# Altium schematic sheet Open Reactor Control System - IO Connections.SchDoc: ORC - IO Connections
size A3; Author: Peake J; CompanyName: Scion Research; DrawnBy: Peake J; Engineer: Peake J; Organization: Scion; Address1: 49 Sala St; Address2: Whakarewarewa; Address3: Rotorua; Address4: New Zealand 3010; DocumentNumber: 0-6; Revision: 5; SheetNumber: 5; SheetTotal: 5
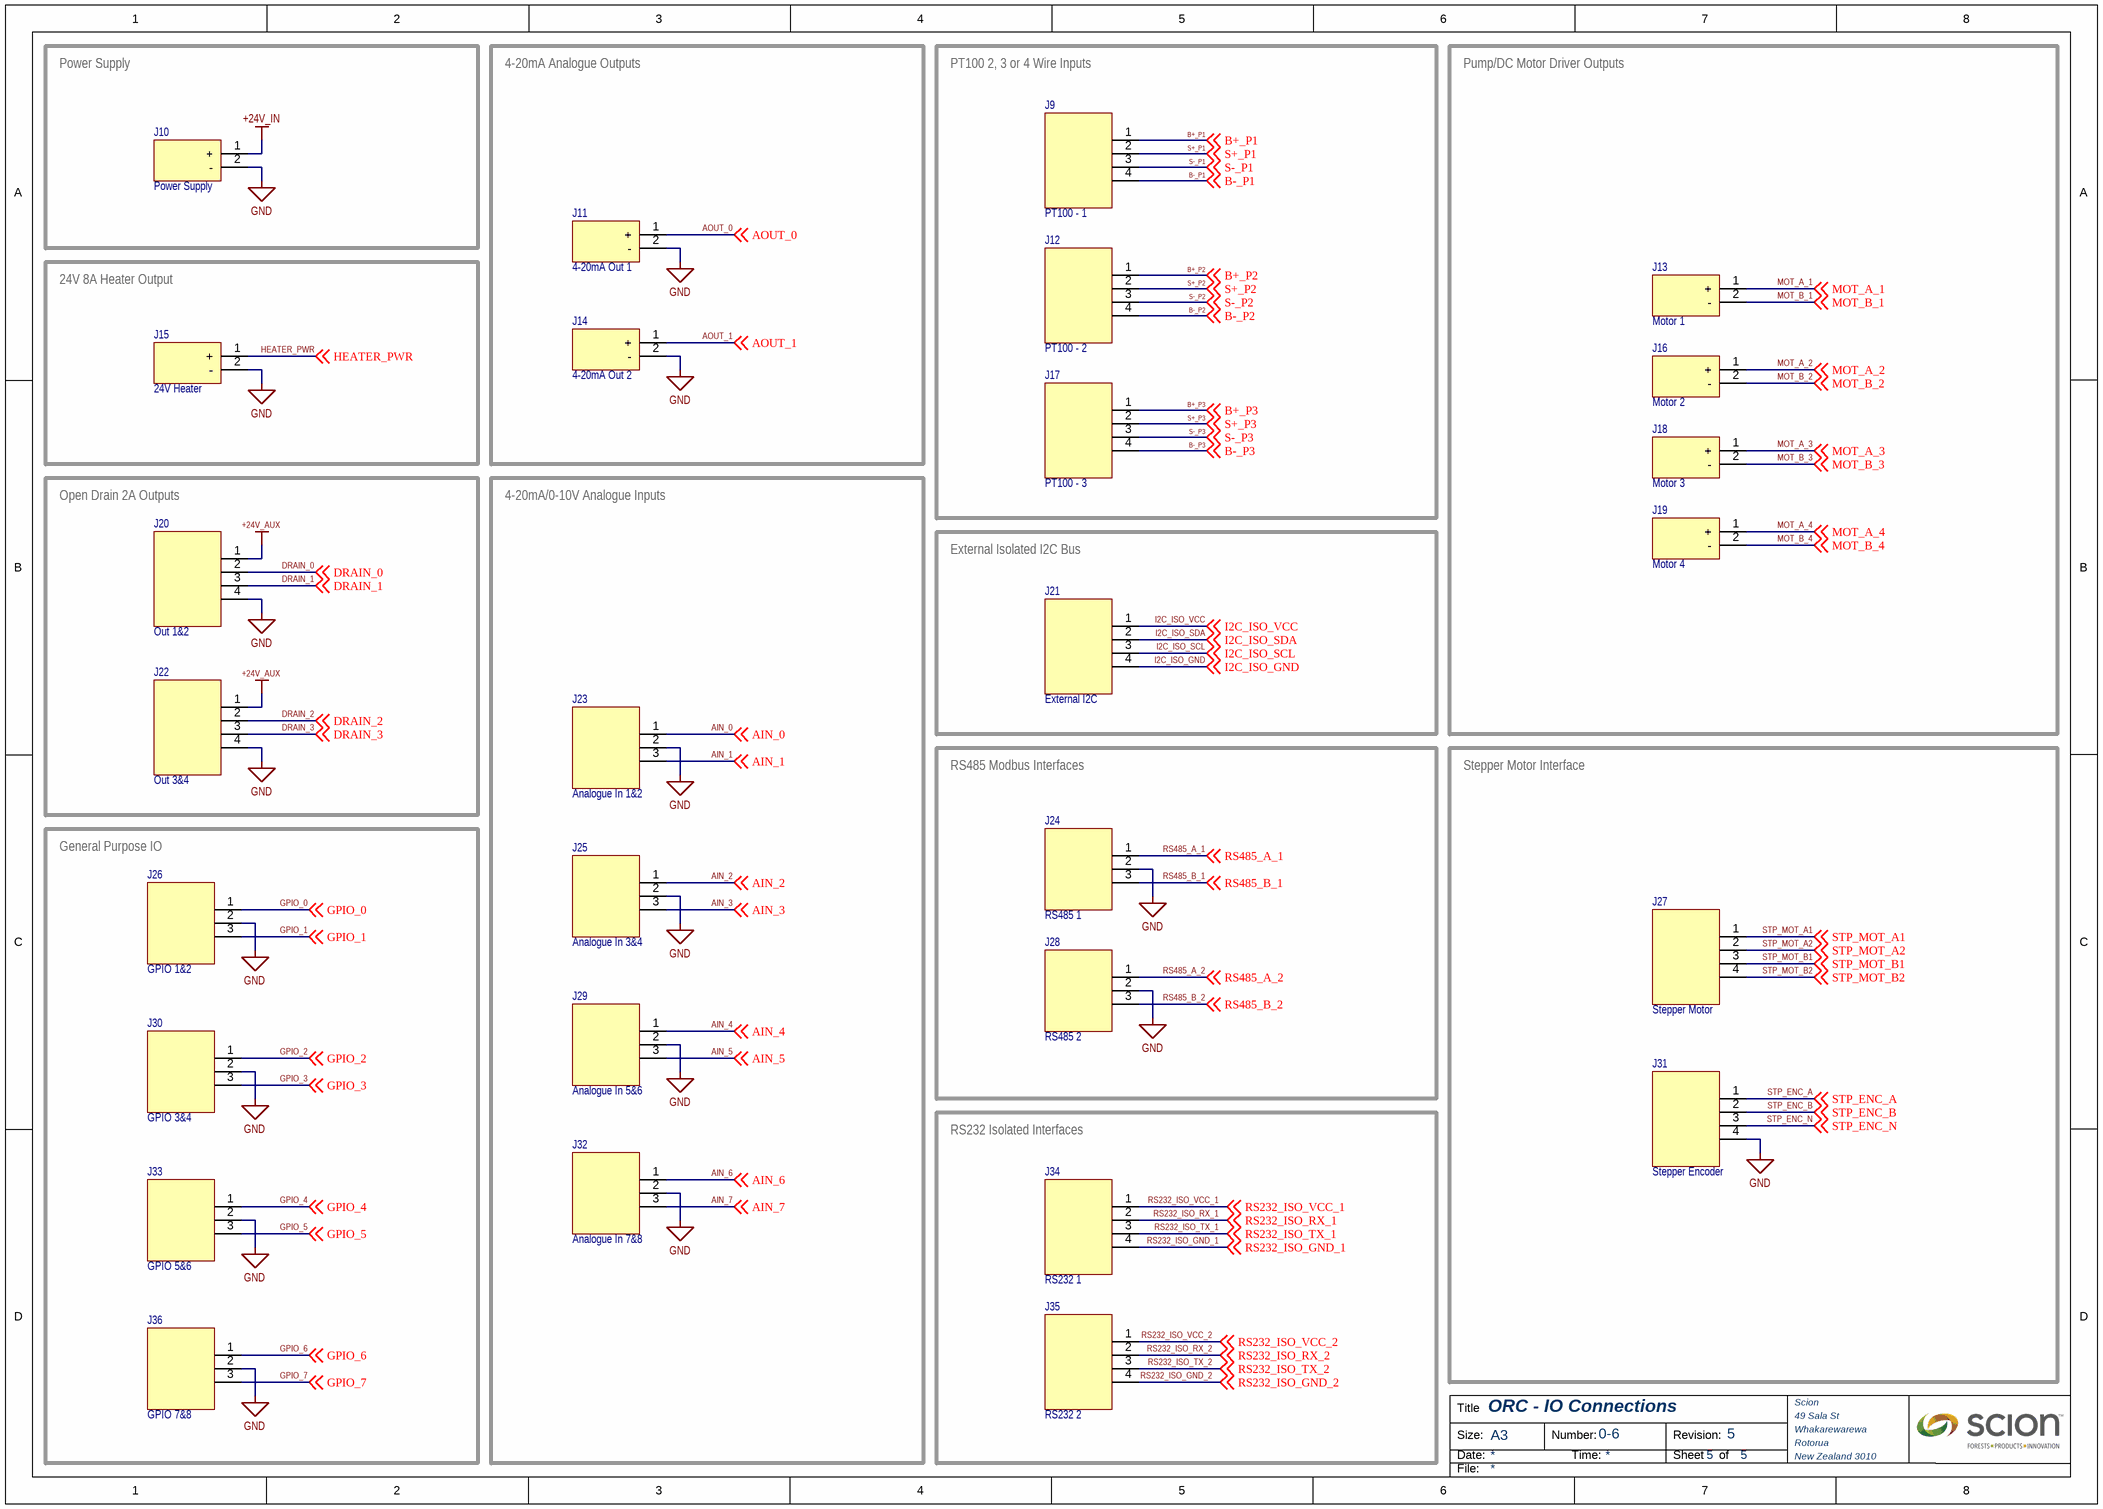
[diagram p0: Open Reactor Control System - IO Connections.SchDoc]

## Parts
J9  PT100 - 1  [4_Pin 3.81mm Molex 395111-004]
J10  Power Supply  [2_Pin 3.81mm Molex 395111-002]
J11  4-20mA Out 1  [2_Pin 3.81mm Molex 395111-002]
J12  PT100 - 2  [4_Pin 3.81mm Molex 395111-004]
J13  Motor 1  [2_Pin 3.81mm Molex 395111-002]
J14  4-20mA Out 2  [2_Pin 3.81mm Molex 395111-002]
J15  24V Heater  [2_Pin 3.81mm Molex 395111-002]
J16  Motor 2  [2_Pin 3.81mm Molex 395111-002]
J17  PT100 - 3  [4_Pin 3.81mm Molex 395111-004]
J18  Motor 3  [2_Pin 3.81mm Molex 395111-002]
J19  Motor 4  [2_Pin 3.81mm Molex 395111-002]
J20  Out 1&2  [4_Pin 3.81mm Molex 395111-004]
J21  External I2C  [4_Pin 3.81mm Molex 395111-004]
J22  Out 3&4  [4_Pin 3.81mm Molex 395111-004]
J23  Analogue In 1&2  [3_Pin 3.81mm Molex 395111-003]
J24  RS485 1  [3_Pin 3.81mm Molex 395111-003]
J25  Analogue In 3&4  [3_Pin 3.81mm Molex 395111-003]
J26  GPIO 1&2  [3_Pin 3.81mm Molex 395111-003]
J27  Stepper Motor  [4_Pin 3.81mm Molex 395111-004]
J28  RS485 2  [3_Pin 3.81mm Molex 395111-003]
J29  Analogue In 5&6  [3_Pin 3.81mm Molex 395111-003]
J30  GPIO 3&4  [3_Pin 3.81mm Molex 395111-003]
J31  Stepper Encoder  [4_Pin 3.81mm Molex 395111-004]
J32  Analogue In 7&8  [3_Pin 3.81mm Molex 395111-003]
J33  GPIO 5&6  [3_Pin 3.81mm Molex 395111-003]
J34  RS232 1  [4_Pin 3.81mm Molex 395111-004]
J35  RS232 2  [4_Pin 3.81mm Molex 395111-004]
J36  GPIO 7&8  [3_Pin 3.81mm Molex 395111-003]

## Blocks framed on the sheet
Power Supply: J10
4-20mA Analogue Outputs: J11 J14
PT100 2, 3 or 4 Wire Inputs: J9 J12 J17
Pump/DC Motor Driver Outputs: J13 J16 J18 J19
24V 8A Heater Output: J15
Open Drain 2A Outputs: J20 J22
4-20mA/0-10V Analogue Inputs: J23 J25 J29 J32
External Isolated I2C Bus: J21
RS485 Modbus Interfaces: J24 J28
Stepper Motor Interface: J27 J31
General Purpose IO: J26 J30 J33 J36
RS232 Isolated Interfaces: J34 J35

## Nets
+24V_AUX: J20.1 J22.1
+24V_IN: J10.1(+)
GND: J10.2(-) J11.2(-) J14.2(-) J15.2(-) J20.4 J22.4 J23.2 J24.2 J25.2 J26.2 J28.2 J29.2 J30.2 J31.4 J32.2 J33.2 J36.2
AIN_0: J23.1 ; off-sheet AIN_0
AIN_1: J23.3 ; off-sheet AIN_1
AIN_2: J25.1 ; off-sheet AIN_2
AIN_3: J25.3 ; off-sheet AIN_3
AIN_4: J29.1 ; off-sheet AIN_4
AIN_5: J29.3 ; off-sheet AIN_5
AIN_6: J32.1 ; off-sheet AIN_6
AIN_7: J32.3 ; off-sheet AIN_7
AOUT_0: J11.1(+) ; off-sheet AOUT_0
AOUT_1: J14.1(+) ; off-sheet AOUT_1
B+_P1: J9.1 ; off-sheet B+_P1
B+_P2: J12.1 ; off-sheet B+_P2
B+_P3: J17.1 ; off-sheet B+_P3
B-_P1: J9.4 ; off-sheet B-_P1
B-_P2: J12.4 ; off-sheet B-_P2
B-_P3: J17.4 ; off-sheet B-_P3
DRAIN_0: J20.2 ; off-sheet DRAIN_0
DRAIN_1: J20.3 ; off-sheet DRAIN_1
DRAIN_2: J22.2 ; off-sheet DRAIN_2
DRAIN_3: J22.3 ; off-sheet DRAIN_3
GPIO_0: J26.1 ; off-sheet GPIO_0
GPIO_1: J26.3 ; off-sheet GPIO_1
GPIO_2: J30.1 ; off-sheet GPIO_2
GPIO_3: J30.3 ; off-sheet GPIO_3
GPIO_4: J33.1 ; off-sheet GPIO_4
GPIO_5: J33.3 ; off-sheet GPIO_5
GPIO_6: J36.1 ; off-sheet GPIO_6
GPIO_7: J36.3 ; off-sheet GPIO_7
HEATER_PWR: J15.1(+) ; off-sheet HEATER_PWR
I2C_ISO_GND: J21.4 ; off-sheet I2C_ISO_GND
I2C_ISO_SCL: J21.3 ; off-sheet I2C_ISO_SCL
I2C_ISO_SDA: J21.2 ; off-sheet I2C_ISO_SDA
I2C_ISO_VCC: J21.1 ; off-sheet I2C_ISO_VCC
MOT_A_1: J13.1(+) ; off-sheet MOT_A_1
MOT_A_2: J16.1(+) ; off-sheet MOT_A_2
MOT_A_3: J18.1(+) ; off-sheet MOT_A_3
MOT_A_4: J19.1(+) ; off-sheet MOT_A_4
MOT_B_1: J13.2(-) ; off-sheet MOT_B_1
MOT_B_2: J16.2(-) ; off-sheet MOT_B_2
MOT_B_3: J18.2(-) ; off-sheet MOT_B_3
MOT_B_4: J19.2(-) ; off-sheet MOT_B_4
RS232_ISO_GND_1: J34.4 ; off-sheet RS232_ISO_GND_1
RS232_ISO_GND_2: J35.4 ; off-sheet RS232_ISO_GND_2
RS232_ISO_RX_1: J34.2 ; off-sheet RS232_ISO_RX_1
RS232_ISO_RX_2: J35.2 ; off-sheet RS232_ISO_RX_2
RS232_ISO_TX_1: J34.3 ; off-sheet RS232_ISO_TX_1
RS232_ISO_TX_2: J35.3 ; off-sheet RS232_ISO_TX_2
RS232_ISO_VCC_1: J34.1 ; off-sheet RS232_ISO_VCC_1
RS232_ISO_VCC_2: J35.1 ; off-sheet RS232_ISO_VCC_2
RS485_A_1: J24.1 ; off-sheet RS485_A_1
RS485_A_2: J28.1 ; off-sheet RS485_A_2
RS485_B_1: J24.3 ; off-sheet RS485_B_1
RS485_B_2: J28.3 ; off-sheet RS485_B_2
S+_P1: J9.2 ; off-sheet S+_P1
S+_P2: J12.2 ; off-sheet S+_P2
S+_P3: J17.2 ; off-sheet S+_P3
S-_P1: J9.3 ; off-sheet S-_P1
S-_P2: J12.3 ; off-sheet S-_P2
S-_P3: J17.3 ; off-sheet S-_P3
STP_ENC_A: J31.1 ; off-sheet STP_ENC_A
STP_ENC_B: J31.2 ; off-sheet STP_ENC_B
STP_ENC_N: J31.3 ; off-sheet STP_ENC_N
STP_MOT_A1: J27.1 ; off-sheet STP_MOT_A1
STP_MOT_A2: J27.2 ; off-sheet STP_MOT_A2
STP_MOT_B1: J27.3 ; off-sheet STP_MOT_B1
STP_MOT_B2: J27.4 ; off-sheet STP_MOT_B2

## Notes on the sheet
- Title
- Size:
- Date:
- A3
- Number:
- Time:
- Revision:
- Sheet
- of
- File:

## Library data of the parts
J9 J12 J17 J20-J22 J27 J31 J34 J35 = CMP-002-00177-2: 4 Pin Connector; Design Item ID: 4_Pin; Component Type: Standard; Pins: 4; Pin Count: 4; Source: Connectors.SchLib; ClassName: StackableConnector
J10 J11 J13-J16 J18 J19 = CMP-002-00173-2: 2 Pin Connector; Design Item ID: 2_Pin; Pins: 2; Pin Count: 2; MFN: *; Component Type: Standard; Source: Connectors.SchLib; ClassName: StackableConnector
J23-J26 J28-J30 J32 J33 J36 = CMP-002-00174-3: 3 Pin Connector; Source: Connectors.SchLib; Component Type: Standard; Pin Count: 3; Pins: 3; Design Item ID: 3_Pin; ClassName: StackableConnector